# Altium schematic sheet 04 IFC.SchDoc
size 420 x 297 mm
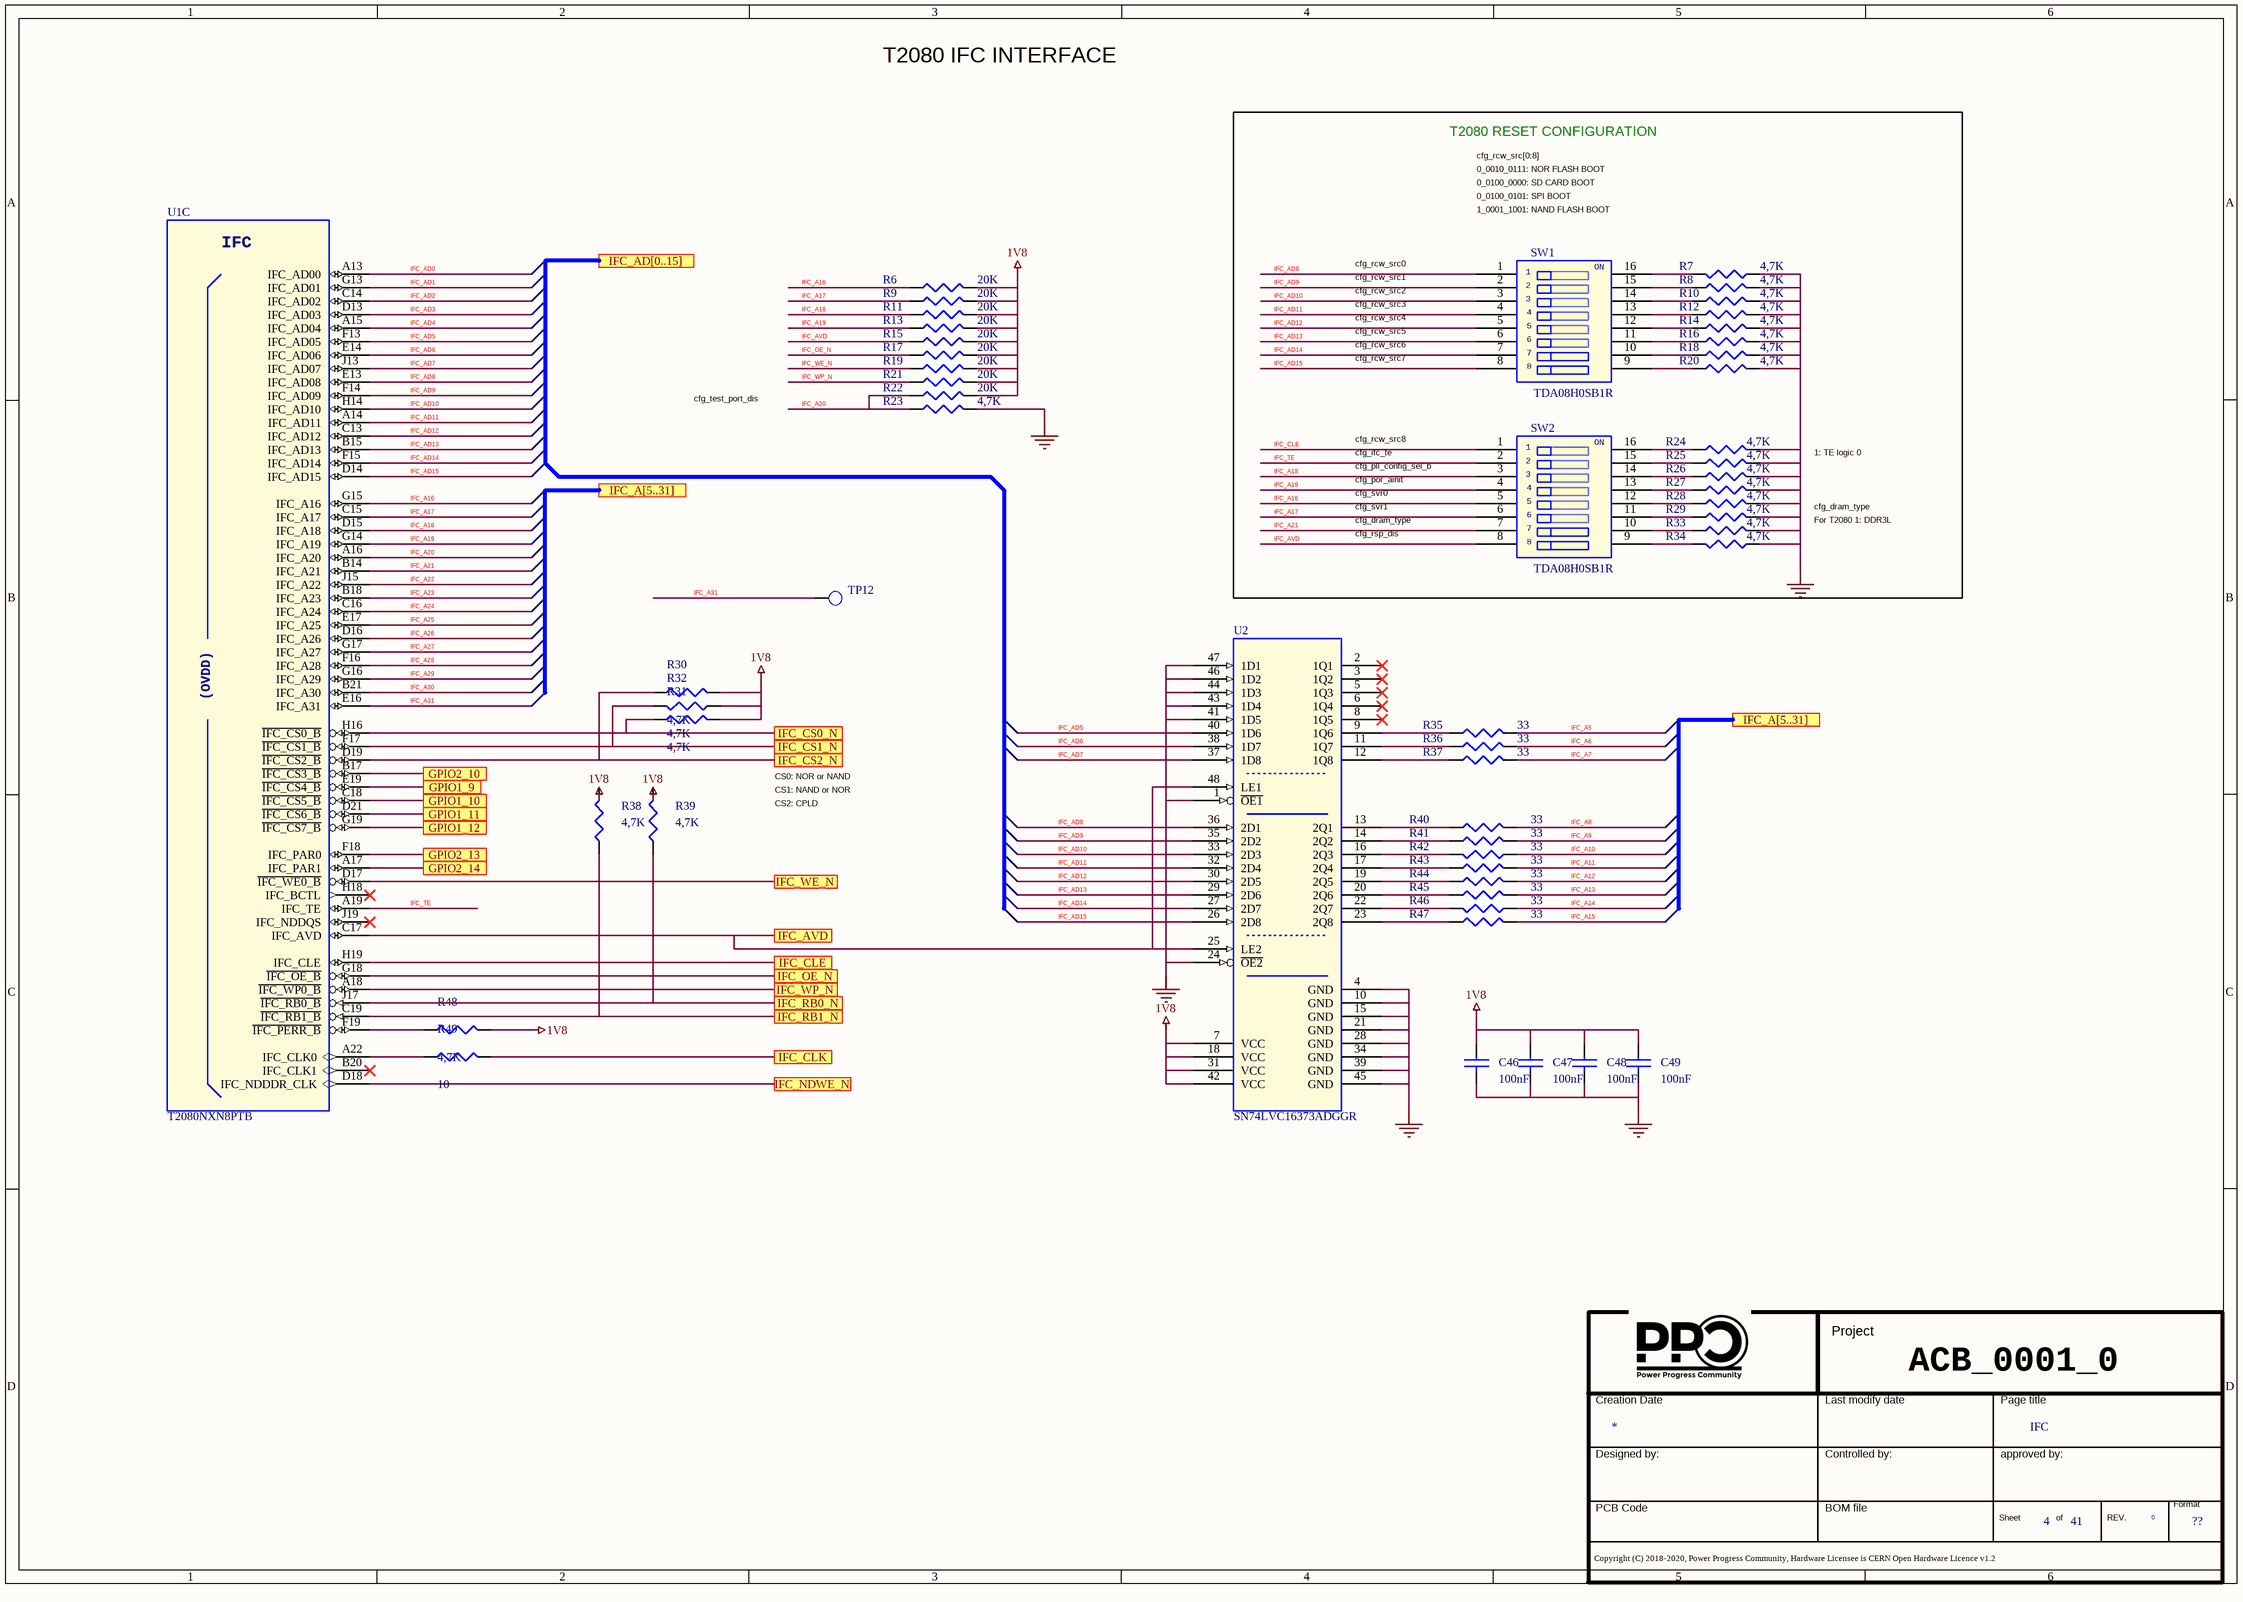
[diagram p0: 04 IFC.SchDoc]

## Parts
*  Doc: IFC  Page Count: 41  Page Number: 4  Page Size: ??  RevCode: 0  (hidden comment: Title_block_PPC)  (graphical)
C46  100nF  [SMD_0402]
C47  100nF  [SMD_0402]
C48  100nF  [SMD_0402]
C49  100nF  [SMD_0402]
R6  20K  [SMD_0402]
R7  4,7K  [SMD_0402]
R8  4,7K  [SMD_0402]
R9  20K  [SMD_0402]
R10  4,7K  [SMD_0402]
R11  20K  [SMD_0402]
R12  4,7K  [SMD_0402]
R13  20K  [SMD_0402]
R14  4,7K  [SMD_0402]
R15  20K  [SMD_0402]
R16  4,7K  [SMD_0402]
R17  20K  [SMD_0402]
R18  4,7K  [SMD_0402]
R19  20K  [SMD_0402]
R20  4,7K  [SMD_0402]
R21  20K  [SMD_0402]
R22  20K  [SMD_0402]
R23  4,7K  [SMD_0402]
R24  4,7K  [SMD_0402]
R25  4,7K  [SMD_0402]
R26  4,7K  [SMD_0402]
R27  4,7K  [SMD_0402]
R28  4,7K  [SMD_0402]
R29  4,7K  [SMD_0402]
R30  4,7K  [SMD_0402]
R31  4,7K  [SMD_0402]
R32  4,7K  [SMD_0402]
R33  4,7K  [SMD_0402]
R34  4,7K  [SMD_0402]
R35  33  [SMD_0402]
R36  33  [SMD_0402]
R37  33  [SMD_0402]
R38  4,7K  [SMD_0402]
R39  4,7K  [SMD_0402]
R40  33  [SMD_0402]
R41  33  [SMD_0402]
R42  33  [SMD_0402]
R43  33  [SMD_0402]
R44  33  [SMD_0402]
R45  33  [SMD_0402]
R46  33  [SMD_0402]
R47  33  [SMD_0402]
R48  4,7K  [SMD_0402]
R49  10  [SMD_0402]
SW1  TDA08H0SB1R  [2X8 PASSO 1.27mm]
SW2  TDA08H0SB1R  [2X8 PASSO 1.27mm]
TP12  TEST POINT  [PCB]  (value not drawn)
U1  T2080NXN8PTB  [bga]  (part C of 14)
U2  SN74LVC16373ADGGR  [tssop_48w]

## Blocks framed on the sheet
T2080 RESET CONFIGURATION: R7 R8 R10 R12 R14 R16 R18 R20 R24-R29 R33 R34 SW1 SW2

## Ports
GPIO1_9, GPIO1_10, GPIO1_11, GPIO1_12, GPIO2_10, GPIO2_13, GPIO2_14, IFC_A[5..31], IFC_AD[0..15], IFC_AVD, IFC_CLE, IFC_CLK, IFC_CS0_N, IFC_CS1_N, IFC_CS2_N, IFC_NDWE_N, IFC_OE_N, IFC_RB0_N, IFC_RB1_N, IFC_WE_N, IFC_WP_N

## Nets
1V8: C46.1 C47.1 C48.1 C49.1 R6.2 R9.2 R11.2 R13.2 R15.2 R17.2 R19.2 R21.2 R22.2 R30.2 R31.2 R32.1 R38.2 R39.2 R48.2 U2.7(VCC) U2.18(VCC) U2.31(VCC) U2.42(VCC)
GND: C46.2 C47.2 C48.2 C49.2 R7.1 R8.2 R10.2 R12.2 R14.2 R16.2 R18.2 R20.2 R23.2 R24.2 R25.2 R26.2 R27.2 R28.2 R29.2 R33.2 R34.1 U2.1(~{OE1}) U2.4(GND) U2.10(GND) U2.15(GND) U2.21(GND) U2.24(~{OE2}) U2.28(GND) U2.34(GND) U2.39(GND) U2.41(1D5) U2.43(1D4) U2.44(1D3) U2.45(GND) U2.46(1D2) U2.47(1D1)
GPIO1_9: U1.E19(~{IFC_CS4_B}) ; port GPIO1_9
GPIO1_10: U1.C18(~{IFC_CS5_B}) ; port GPIO1_10
GPIO1_11: U1.D21(~{IFC_CS6_B}) ; port GPIO1_11
GPIO1_12: U1.G19(~{IFC_CS7_B}) ; port GPIO1_12
GPIO2_10: U1.B17(~{IFC_CS3_B}) ; port GPIO2_10
GPIO2_13: U1.F18(IFC_PAR0) ; port GPIO2_13
GPIO2_14: U1.A17(IFC_PAR1) ; port GPIO2_14
IFC_A5: R35.2
IFC_A6: R36.2
IFC_A7: R37.2
IFC_A8: R40.2
IFC_A9: R41.2
IFC_A10: R42.1
IFC_A11: R43.2
IFC_A12: R44.2
IFC_A13: R45.2
IFC_A14: R46.1
IFC_A15: R47.2
IFC_A16: R6.1 SW2.5 U1.G15(IFC_A16)
IFC_A17: R9.1 SW2.6 U1.C15(IFC_A17)
IFC_A18: R11.1 SW2.3 U1.D15(IFC_A18)
IFC_A19: R13.1 SW2.4 U1.G14(IFC_A19)
IFC_A20: R22.1 R23.1 U1.A16(IFC_A20)
IFC_A21: SW2.7 U1.B14(IFC_A21)
IFC_A22: U1.J15(IFC_A22)
IFC_A23: U1.B18(IFC_A23)
IFC_A24: U1.C16(IFC_A24)
IFC_A25: U1.E17(IFC_A25)
IFC_A26: U1.D16(IFC_A26)
IFC_A27: U1.G17(IFC_A27)
IFC_A28: U1.F16(IFC_A28)
IFC_A29: U1.G16(IFC_A29)
IFC_A30: U1.B21(IFC_A30)
IFC_A31: TP12.1(TP) U1.E16(IFC_A31)
IFC_AD0: U1.A13(IFC_AD00)
IFC_AD1: U1.G13(IFC_AD01)
IFC_AD2: U1.C14(IFC_AD02)
IFC_AD3: U1.D13(IFC_AD03)
IFC_AD4: U1.A15(IFC_AD04)
IFC_AD5: U1.F13(IFC_AD05) U2.40(1D6)
IFC_AD6: U1.E14(IFC_AD06) U2.38(1D7)
IFC_AD7: U1.J13(IFC_AD07) U2.37(1D8)
IFC_AD8: SW1.1 U1.E13(IFC_AD08) U2.36(2D1)
IFC_AD9: SW1.2 U1.F14(IFC_AD09) U2.35(2D2)
IFC_AD10: SW1.3 U1.H14(IFC_AD10) U2.33(2D3)
IFC_AD11: SW1.4 U1.A14(IFC_AD11) U2.32(2D4)
IFC_AD12: SW1.5 U1.C13(IFC_AD12) U2.30(2D5)
IFC_AD13: SW1.6 U1.B15(IFC_AD13) U2.29(2D6)
IFC_AD14: SW1.7 U1.F15(IFC_AD14) U2.27(2D7)
IFC_AD15: SW1.8 U1.D14(IFC_AD15) U2.26(2D8)
IFC_AVD: R15.1 SW2.8
IFC_AVD: U1.C17(IFC_AVD) U2.25(LE2) U2.48(LE1) ; port IFC_AVD  [a separate net that carries the same name]
IFC_CLE: SW2.1
IFC_CLE: U1.H19(IFC_CLE) ; port IFC_CLE  [a separate net that carries the same name]
IFC_CLK: R49.2 ; port IFC_CLK
IFC_CS0_N: R31.1 U1.H16(~{IFC_CS0_B}) ; port IFC_CS0_N
IFC_CS1_N: R32.2 U1.F17(~{IFC_CS1_B}) ; port IFC_CS1_N
IFC_CS2_N: R30.1 U1.D19(~{IFC_CS2_B}) ; port IFC_CS2_N
IFC_NDWE_N: U1.D18(IFC_NDDDR_CLK) ; port IFC_NDWE_N
IFC_OE_N: R17.1
IFC_OE_N: U1.G18(~{IFC_OE_B}) ; port IFC_OE_N  [a separate net that carries the same name]
IFC_RB0_N: R39.1 U1.J17(~{IFC_RB0_B}) ; port IFC_RB0_N
IFC_RB1_N: R38.1 U1.C19(~{IFC_RB1_B}) ; port IFC_RB1_N
IFC_TE: SW2.2 U1.A19(IFC_TE)
IFC_WE_N: U1.D17(~{IFC_WE0_B}) ; port IFC_WE_N
IFC_WE_N: R19.1  [a separate net that carries the same name]
IFC_WP_N: R21.1
IFC_WP_N: U1.A18(~{IFC_WP0_B}) ; port IFC_WP_N  [a separate net that carries the same name]
NetR7_2: R7.2 SW1.16
NetR8_1: R8.1 SW1.15
NetR10_1: R10.1 SW1.14
NetR12_1: R12.1 SW1.13
NetR14_1: R14.1 SW1.12
NetR16_1: R16.1 SW1.11
NetR18_1: R18.1 SW1.10
NetR20_1: R20.1 SW1.9
NetR24_1: R24.1 SW2.16
NetR25_1: R25.1 SW2.15
NetR26_1: R26.1 SW2.14
NetR27_1: R27.1 SW2.13
NetR28_1: R28.1 SW2.12
NetR29_1: R29.1 SW2.11
NetR33_1: R33.1 SW2.10
NetR34_2: R34.2 SW2.9
NetR35_1: R35.1 U2.9(1Q6)
NetR36_1: R36.1 U2.11(1Q7)
NetR37_1: R37.1 U2.12(1Q8)
NetR40_1: R40.1 U2.13(2Q1)
NetR41_1: R41.1 U2.14(2Q2)
NetR42_2: R42.2 U2.16(2Q3)
NetR43_1: R43.1 U2.17(2Q4)
NetR44_1: R44.1 U2.19(2Q5)
NetR45_1: R45.1 U2.20(2Q6)
NetR46_2: R46.2 U2.22(2Q7)
NetR47_1: R47.1 U2.23(2Q8)
NetR48_1: R48.1 U1.F19(~{IFC_PERR_B})
NetR49_1: R49.1 U1.A22(IFC_CLK0)

Not connected (* = marked no-connect by the designer): U1 B20(IFC_CLK1)* H18(IFC_BCTL)* J19(IFC_NDDQS)*; U2 2(1Q1)* 3(1Q2)* 5(1Q3)* 6(1Q4)* 8(1Q5)*

## Notes on the sheet
- T2080 IFC INTERFACE
- 0_0010_0111: NOR FLASH BOOT
- 0_0100_0000: SD CARD BOOT
- cfg_rcw_src[0:8]
- 0_0100_0101: SPI BOOT
- 1_0001_1001: NAND FLASH BOOT
- cfg_rcw_src0
- cfg_rcw_src1
- cfg_rcw_src2
- cfg_rcw_src3
- cfg_rcw_src4
- cfg_rcw_src5
- cfg_rcw_src6
- cfg_rcw_src7
- cfg_test_port_dis
- cfg_rcw_src8
- cfg_ifc_te
- 1: TE logic 0
- cfg_pll_config_sel_b
- cfg_por_ainit
- cfg_svr0
- cfg_svr1
- cfg_dram_type
- For T2080 1: DDR3L
- cfg_rsp_dis
- CS0: NOR or NAND
- CS1: NAND or NOR
- CS2: CPLD
- ACB_0001_0
- (in symbol DIP_SWITCH_8) ON
- (in symbol T2080, part C) IFC; (OVDD)
- (in symbol Title_block_PPC) Project; Creation Date; Last modify date; Page title; Designed by:; Controlled by:; approved by:; Format; PCB Code; BOM file; Sheet; of; REV.; Copyright (C) 2018-2020, Power Progress Community, Hardware Licensee is CERN Open Hardware Licence v1.2

## Library data of the parts
* = Title_block_PPC: Title: T2080PCIe; Schematic Page Count: 45; Schematic Page Number: 5; Author: MICETEK; Page Create Date: March  8, 1995; Page Title: ?; Page Modify Date: *
C46-C49 = CAP NP_Dup2: COND.CER. 100NF 50V 0402 X7R SMD; Manufacturer Part Number 1: CGA2B3X7R1H104M050BD; Manufacturer 1: TDK; Part Number: PASSIVE_24; RSM: RC0402; PCB Footprint: SMD_0402; Part Type: Capacitors\Ceramic\SMD\0402
R6 R9 R13 R15 R17 R21 R22 = R_Dup5: RESIS.CHIP 20K 1% 0402 SMD; Manufacturer Part Number 1: RC0402FR-1320KL; Manufacturer 1: YAGEO; Part Number: PASSIVE_641; RSM: RC0402; Part Type: Resistors\Fixed\SMD\0402\1%; PCB Footprint: SMD_0402
R7 R8 R10 R12 = R_Dup5: RESIS.CHIP 4,7K 5% 0402 SMD; Part Number: PASSIVE_861; Manufacturer 1: ROYAL OHM; RSM: RC0402; Part Type: Resistors\Fixed\SMD\0402\5%; Manufacturer Part Number 1: RESIS.CHIP 4,7K 5% 0402 SMD; PCB Footprint: SMD_0402
R11 R19 = R_Dup5: RESIS.CHIP 20K 1% 0402 SMD; Part Number: PASSIVE_641; Manufacturer 1: YAGEO; Manufacturer Part Number 1: RC0402FR-1320KL; RSM: RC0402; Part Type: Resistors\Fixed\SMD\0402\1%; PCB Footprint: SMD_0402
R14 R16 R18 R20 R23-R34 R38 R39 R48 = R_Dup5: RESIS.CHIP 4,7K 5% 0402 SMD; Manufacturer 1: ROYAL OHM; Part Number: PASSIVE_861; RSM: RC0402; Manufacturer Part Number 1: RESIS.CHIP 4,7K 5% 0402 SMD; Part Type: Resistors\Fixed\SMD\0402\5%; PCB Footprint: SMD_0402
R35-R37 R42-R45 R47 = R_Dup5: RESIS.CHIP 33R 5% 0402 SMD; Manufacturer 1: ROYAL OHM; Part Number: PASSIVE_853; RSM: RC0402; Manufacturer Part Number 1: RESIS.CHIP 33R 5% 0402 SMD; Part Type: Resistors\Fixed\SMD\0402\5%; PCB Footprint: SMD_0402
R40 R41 R46 = R_Dup5: RESIS.CHIP 33R 5% 0402 SMD; Part Number: PASSIVE_853; Manufacturer 1: ROYAL OHM; RSM: RC0402; Part Type: Resistors\Fixed\SMD\0402\5%; Manufacturer Part Number 1: RESIS.CHIP 33R 5% 0402 SMD; PCB Footprint: SMD_0402
R49 = R_Dup5: RESIS.CHIP 10R 5% 0402 SMD; Manufacturer 1: ROYAL OHM; Part Number: PASSIVE_811; RSM: RC0402; Manufacturer Part Number 1: RESIS.CHIP 10R 5% 0402 SMD; Part Type: Resistors\Fixed\SMD\0402\5%; PCB Footprint: SMD_0402
SW1 = DIP_SWITCH_8: SWITCH DIP SIP HALF 8POS SMD; Part Number: CONNECTORS_645; Manufacturer 1: C&k; RSM: DSW-GDH8; PCB Footprint: 2X8 PASSO 1.27mm; Part Type: DIPSWITCH; Manufacturer Part Number 1: TDA08H0SB1R; Distributor 1: MOUSER(611-TDA08H0SB1R)
SW2 = DIP_SWITCH_8: SWITCH DIP SIP HALF 8POS SMD; Manufacturer 1: C&k; Part Number: CONNECTORS_645; RSM: DSW-GDH8; PCB Footprint: 2X8 PASSO 1.27mm; Distributor 1: MOUSER(611-TDA08H0SB1R); Manufacturer Part Number 1: TDA08H0SB1R; Part Type: DIPSWITCH
TP12 = T POINT R: TEST POINT SU PCB; Part Number: CONNECTORS_542; RSM: AE-TESTPOINT; PCB Footprint: PCB; Part Type: Tpoint
U1 = T2080: QRIQ MPU 1.87GT/s DDR3/3L 4x10GE; Manufacturer 1: NXP; Part Number: MICROPROCESSOR_65; PCB Footprint: BGA896; Vendor: Freescale; RSM: PBGA896-0_8MM-25X25; Distributor 1: MOUSER(841-T2080NXN8PTB); Manufacturer Part Number 1: T2080NXN8PTB; Part Type: 32 BIT; MPN: T2080; TYPE: IC
U2 = 74LVC16373: IC TRANS D-TYP LATCH 3ST 48TSSOP; Manufacturer 1: TEXAS; Part Number: LOGIC_350; PCB Footprint: TSSOP-48; Vendor: TI; Distributor 1: DIGIKEY(296-13241-1-ND); Manufacturer Part Number 1: SN74LVC16373ADGGR; Part Type: LVC\STD; TYPE: IC; MPN: SN74LVC16373ADGGR; RSM: TSSOP-48